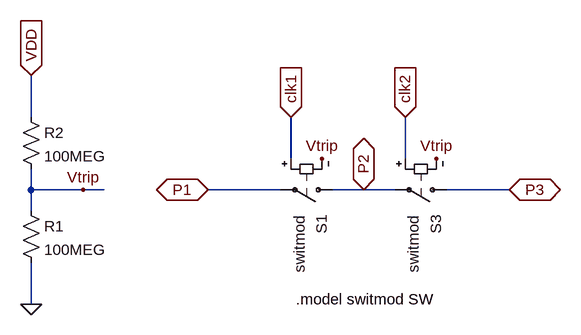
[diagram p0: schematic switches_2.asc]
switches_2.asc, the LTspice schematic file:
Version 4
SHEET 1 2740 696
WIRE 80 -848 80 -912
WIRE 480 -784 480 -848
WIRE 656 -784 656 -848
WIRE 80 -736 80 -768
WIRE 160 -736 80 -736
WIRE 192 -736 160 -736
WIRE 464 -736 352 -736
WIRE 592 -736 544 -736
WIRE 640 -736 592 -736
WIRE 816 -736 720 -736
WIRE 80 -704 80 -736
WIRE 80 -560 80 -624
FLAG 160 -736 Vtrip
FLAG 80 -912 VDD
IOPIN 80 -912 In
FLAG 80 -560 0
FLAG 528 -784 Vtrip
FLAG 704 -784 Vtrip
FLAG 816 -736 P3
IOPIN 816 -736 BiDir
FLAG 352 -736 P1
IOPIN 352 -736 BiDir
FLAG 480 -848 clk1
IOPIN 480 -848 In
FLAG 656 -848 clk2
IOPIN 656 -848 In
FLAG 592 -736 P2
IOPIN 592 -736 BiDir
SYMBOL sw 560 -736 R90
WINDOW 3 24 -12 Left 0
WINDOW 38 39 67 Left 0
WINDOW 0 38 33 Left 0
SYMATTR Value ""
SYMATTR SpiceModel switmod
SYMATTR InstName S1
SYMBOL res 64 -720 R0
SYMATTR InstName R1
SYMATTR Value 100MEG
SYMBOL res 64 -864 R0
SYMATTR InstName R2
SYMATTR Value 100MEG
SYMBOL sw 736 -736 R90
WINDOW 3 24 -12 Left 0
WINDOW 38 39 67 Left 0
WINDOW 0 38 33 Left 0
SYMATTR Value ""
SYMATTR SpiceModel switmod
SYMATTR InstName S3
TEXT 488 -568 Left 0 !.model switmod SW

The netlist it stands for:
* switches_2.asc
S1 P2 P1 clk1 Vtrip switmod
R1 Vtrip 0 100MEG
R2 VDD Vtrip 100MEG
S3 P3 P2 clk2 Vtrip switmod
.model switmod SW
.backanno
.end